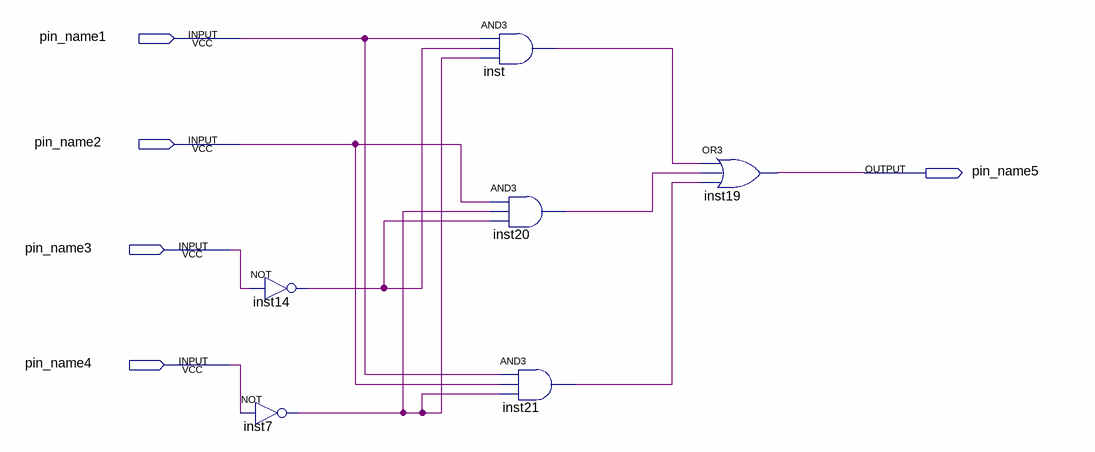
[diagram p0: schematic sheet]
// Quartus schematic f (2022_05_22 18_19_10 UTC).bdf as structural Verilog: 6 symbols, 5 pins
module \f_(2022_05_22_18_19_10_UTC)  (
  input  pin_name1,
  input  pin_name2,
  input  pin_name3,
  input  pin_name4,
  output pin_name5
);

  wire inst7_out, inst14_out, inst20_out, inst21_out, inst_out;

  not inst14 (inst14_out, pin_name3);
  not inst7 (inst7_out, pin_name4);
  and inst (inst_out, pin_name1, inst14_out, inst7_out);
  and inst20 (inst20_out, pin_name2, inst7_out, inst14_out);
  and inst21 (inst21_out, pin_name1, pin_name2, inst7_out);
  or inst19 (pin_name5, inst_out, inst20_out, inst21_out);
endmodule
